# EAGLE schematic MODULO2_def (EAGLE 7.1.0)
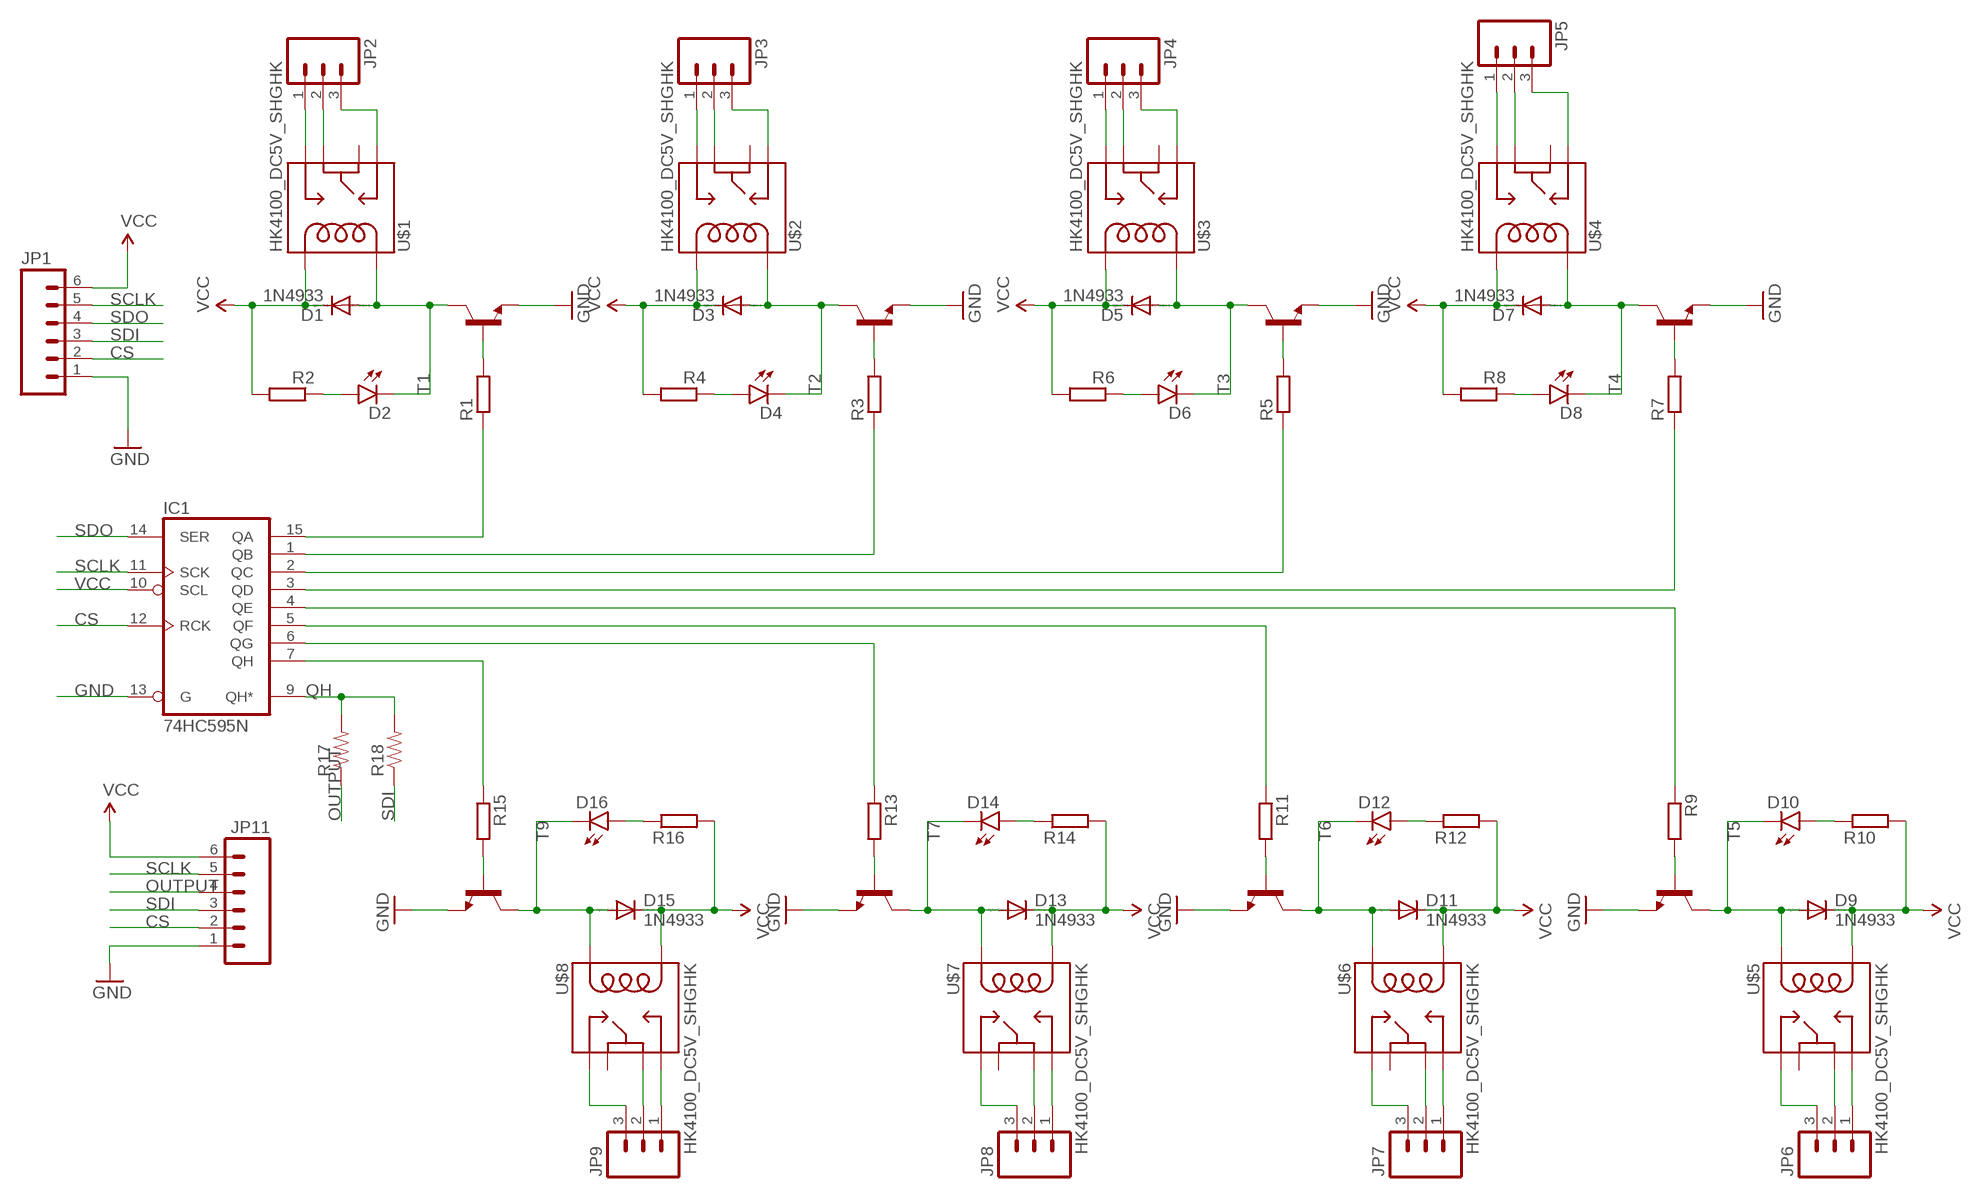
[diagram p0: schematic, sheet 1]

## Parts
D1  1N4933  [DO41-10]
D2  LED5MM  [LED5MM]
D3  1N4933  [DO41-10]
D4  LED5MM  [LED5MM]
D5  1N4933  [DO41-10]
D6  LED5MM  [LED5MM]
D7  1N4933  [DO41-10]
D8  LED5MM  [LED5MM]
D9  1N4933  [DO41-10]
D10  LED5MM  [LED5MM]
D11  1N4933  [DO41-10]
D12  LED5MM  [LED5MM]
D13  1N4933  [DO41-10]
D14  LED5MM  [LED5MM]
D15  1N4933  [DO41-10]
D16  LED5MM  [LED5MM]
IC1  74HC595N  [DIL16]
JP1  M06LOCK  [1X06_LOCK]
JP2  M03-SCREW-5MM  [SCREWTERMINAL-5MM-3]
JP3  M03-SCREW-5MM  [SCREWTERMINAL-5MM-3]
JP4  M03-SCREW-5MM  [SCREWTERMINAL-5MM-3]
JP5  M03-SCREW-5MM  [SCREWTERMINAL-5MM-3]
JP6  M03-SCREW-5MM  [SCREWTERMINAL-5MM-3]
JP7  M03-SCREW-5MM  [SCREWTERMINAL-5MM-3]
JP8  M03-SCREW-5MM  [SCREWTERMINAL-5MM-3]
JP9  M03-SCREW-5MM  [SCREWTERMINAL-5MM-3]
JP11  M06LOCK  [1X06_LOCK]
R1  R-EU_R0805  [R0805]
R2  R-EU_R0805  [R0805]
R3  R-EU_R0805  [R0805]
R4  R-EU_R0805  [R0805]
R5  R-EU_R0805  [R0805]
R6  R-EU_R0805  [R0805]
R7  R-EU_R0805  [R0805]
R8  R-EU_R0805  [R0805]
R9  R-EU_R0805  [R0805]
R10  R-EU_R0805  [R0805]
R11  R-EU_R0805  [R0805]
R12  R-EU_R0805  [R0805]
R13  R-EU_R0805  [R0805]
R14  R-EU_R0805  [R0805]
R15  R-EU_R0805  [R0805]
R16  R-EU_R0805  [R0805]
R17  RESISTOR0805-RES  [0805]
R18  RESISTOR0805-RES  [0805]
T1  -NPN-TO92-EBC  [TO92-EBC]
T2  -NPN-TO92-EBC  [TO92-EBC]
T3  -NPN-TO92-EBC  [TO92-EBC]
T4  -NPN-TO92-EBC  [TO92-EBC]
T5  -NPN-TO92-EBC  [TO92-EBC]
T6  -NPN-TO92-EBC  [TO92-EBC]
T7  -NPN-TO92-EBC  [TO92-EBC]
T9  -NPN-TO92-EBC  [TO92-EBC]
U$1  HK4100_DC5V_SHGHK  [HK4100]
U$2  HK4100_DC5V_SHGHK  [HK4100]
U$3  HK4100_DC5V_SHGHK  [HK4100]
U$4  HK4100_DC5V_SHGHK  [HK4100]
U$5  HK4100_DC5V_SHGHK  [HK4100]
U$6  HK4100_DC5V_SHGHK  [HK4100]
U$7  HK4100_DC5V_SHGHK  [HK4100]
U$8  HK4100_DC5V_SHGHK  [HK4100]

## Nets
CS: IC1.12(RCK) JP1.2 JP11.2
GND: IC1.13(G) JP1.1 JP11.1 T1.E T2.E T3.E T4.E T5.E T6.E T7.E T9.E
N$1: IC1.15(QA) R1.1
N$2: IC1.1(QB) R3.1
N$3: D1.A D2.K(C) T1.C U$1.6
N$4: D2.A R2.1
N$5: R1.2 T1.B
N$6: D3.A D4.K(C) T2.C U$2.6
N$7: D5.A D6.K(C) T3.C U$3.6
N$8: D6.A R6.1
N$9: R5.2 T3.B
N$10: D7.A D8.K(C) T4.C U$4.6
N$11: D8.A R8.1
N$12: R7.2 T4.B
N$13: IC1.3(QD) R7.1
N$14: D4.A R4.1
N$15: R3.2 T2.B
N$16: IC1.2(QC) R5.1
N$17: D9.A D10.K(C) T5.C U$5.6
N$18: D10.A R10.1
N$19: R9.2 T5.B
N$20: D11.A D12.K(C) T6.C U$6.6
N$21: D12.A R12.1
N$22: R11.2 T6.B
N$23: D13.A D14.K(C) T7.C U$7.6
N$24: D14.A R14.1
N$25: R13.2 T7.B
N$26: D15.A D16.K(C) T9.C U$8.6
N$27: D16.A R16.1
N$28: R15.2 T9.B
N$29: IC1.5(QF) R11.1
N$30: IC1.4(QE) R9.1
N$31: IC1.6(QG) R13.1
N$32: IC1.7(QH) R15.1
N$33: JP2.1 U$1.8
N$34: JP2.2 U$1.14
N$35: JP2.3 U$1.7
N$36: JP3.1 U$2.8
N$37: JP3.2 U$2.14
N$38: JP3.3 U$2.7
N$39: JP4.1 U$3.8
N$40: JP4.2 U$3.14
N$41: JP4.3 U$3.7
N$42: JP5.1 U$4.8
N$43: JP5.2 U$4.14
N$44: JP5.3 U$4.7
N$45: JP6.1 U$5.8
N$46: JP6.2 U$5.14
N$47: JP6.3 U$5.7
N$48: JP7.1 U$6.8
N$49: JP7.2 U$6.14
N$50: JP7.3 U$6.7
N$51: JP8.1 U$7.8
N$52: JP8.2 U$7.14
N$53: JP8.3 U$7.7
N$54: JP9.1 U$8.8
N$55: JP9.2 U$8.14
N$56: JP9.3 U$8.7
OUTPUT: JP11.4 R17.1
QH: IC1.9(QH*) R17.2 R18.2
SCLK: IC1.11(SCK) JP1.5 JP11.5
SDI: JP1.3 JP11.3 R18.1
SDO: IC1.14(SER) JP1.4
VCC: D1.C D3.C D5.C D7.C D9.C D11.C D13.C D15.C IC1.10(SCL) JP1.6 JP11.6 R2.2 R4.2 R6.2 R8.2 R10.2 R12.2 R14.2 R16.2 U$1.9 U$2.9 U$3.9 U$4.9 U$5.9 U$6.9 U$7.9 U$8.9
Unconnected: U$1.1 U$2.1 U$3.1 U$4.1 U$5.1 U$6.1 U$7.1 U$8.1

## Power pins joined to a net without a drawn wire
GND: IC1.8(GND)
VCC: IC1.16(VCC)

## Library data of the parts
D1 D3 D5 D7 D9 D11 D13 D15 = diode:1N4933: DIODE fast recovery rectifier, 1A
D2 D4 D6 D8 D10 D12 D14 D16 = SparkFun-LED:LED: LEDs Standard schematic elements and footprints for 5mm, 3mm, 1206, and 0603 sized LEDs. 5mm - Spark Fun Electronics SKU : COM-00529 (and others)
IC1 = 74xx-eu:74*595: 8-bit SHIFT REGISTER, output latch
JP1 JP11 = SparkFun-Connectors:M06: Header 6 Standard 6-pin 0.1" header. Use with straight break away headers (SKU : PRT-00116), right angle break away headers (PRT-00553), swiss pins (PRT-00743), machine pins (PRT-00117), and female headers (PRT-00115). Molex polarized connector foot print use with SKU : PRT-08094 with associated crimp pins and housings. NOTES ON THE VARIANTS LOCK and LOCK_LONGPADS... This footprint was designed to help hold the alignment of a through-hole component (i.e. 6-pin header) while soldering it into place. You may notice that each hole has been shifted either up or down by 0.005 of an inch from it's more standard position (which is a perfectly straight line). This slight alteration caused the pins (the squares in the middle) to touch the edges of the holes. Because they are alternating, it causes a "brace" to hold the component in place. 0.005 has proven to be the perfect amount of "off-center" position when using our standard breakaway headers. Although looks a little odd when you look at the bare footprint, once you have a header in there, the alteration is very hard to notice. Also,if you push a header all the way into place, it is covered up entirely on the bottom side. This idea of altering the position of holes to aid alignment will be further integrated into the Sparkfun Library for other footprints. It can help hold any component with 3 or more connection pins.
JP2-JP9 = SparkFun-Connectors:M03: Header 3 Standard 3-pin 0.1" header. Use with straight break away headers (SKU : PRT-00116), right angle break away headers (PRT-00553), swiss pins (PRT-00743), machine pins (PRT-00117), and female headers (PRT-00115). Molex polarized connector foot print use with SKU : PRT-08232 with associated crimp pins and housings.; STOREFRONT_ID: PRT-08433
R1-R16 = resistor:R-EU_: RESISTOR, European symbol
R17 R18 = SparkFun-Resistors:RESISTOR: Resistor Basic schematic elements and footprints for 0603, 1206, and PTH resistors.
T1-T7 T9 = transistor:*-NPN-: NPN Transistror BF959 corrected 2008.03.06
U$1-U$8 = SparkFun-Electromechanical:HK4100_DC5V_SHG